# EAGLE schematic Simple_Motherboard (EAGLE 6.5.0)

## Sheet 1 of 7: Power
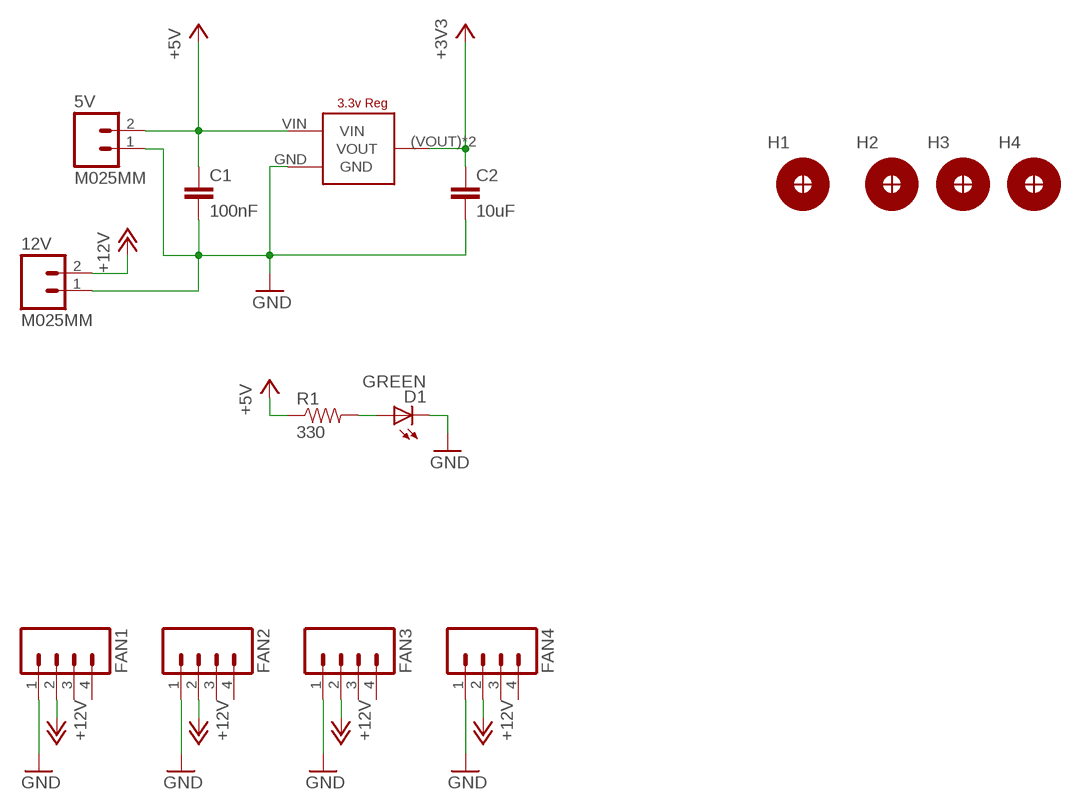
[diagram p0: schematic, sheet 1]

### Parts
5V  M025MM  [SCREWTERMINAL-5MM-2]
12V  M025MM  [SCREWTERMINAL-5MM-2]
C1  100nF  CAP1206  [1206]
C2  10uF  CAP1206  [1206]
D1  GREEN  LED-GREENLARGE  [LED-1206]
FAN1  M04LONGPADS  [1X04_LONGPADS]
FAN2  M04LONGPADS  [1X04_LONGPADS]
FAN3  M04LONGPADS  [1X04_LONGPADS]
FAN4  M04LONGPADS  [1X04_LONGPADS]
H1  H_MNTHOLE_#4  [H_MNTHOLE_#4]
H2  H_MNTHOLE_#4  [H_MNTHOLE_#4]
H3  H_MNTHOLE_#4  [H_MNTHOLE_#4]
H4  H_MNTHOLE_#4  [H_MNTHOLE_#4]
R1  330  RESISTOR1206  [1206]
U$1  LD1117  [LD1117SOT-223]

### Nets
+3V3: C2.1 U$1.(VOUT)(VOUT) U$1.VOUT ; also sheet 3,5,6,7
+5V: 5V.2 C1.1 R1.1 U$1.VIN ; also sheet 2,4,7
+12V: 12V.2 FAN1.2 FAN2.2 FAN3.2 FAN4.2
GND: 5V.1 12V.1 C1.2 C2.2 D1.C FAN1.1 FAN2.1 FAN3.1 FAN4.1 U$1.GND ; also sheet 2,3,4,5,6,7
N$45: D1.A R1.2
Unconnected: FAN1.3 FAN1.4 FAN2.3 FAN2.4 FAN3.3 FAN3.4 FAN4.3 FAN4.4 H1.1 H2.1 H3.1 H4.1

## Sheet 2 of 7: Launchpad
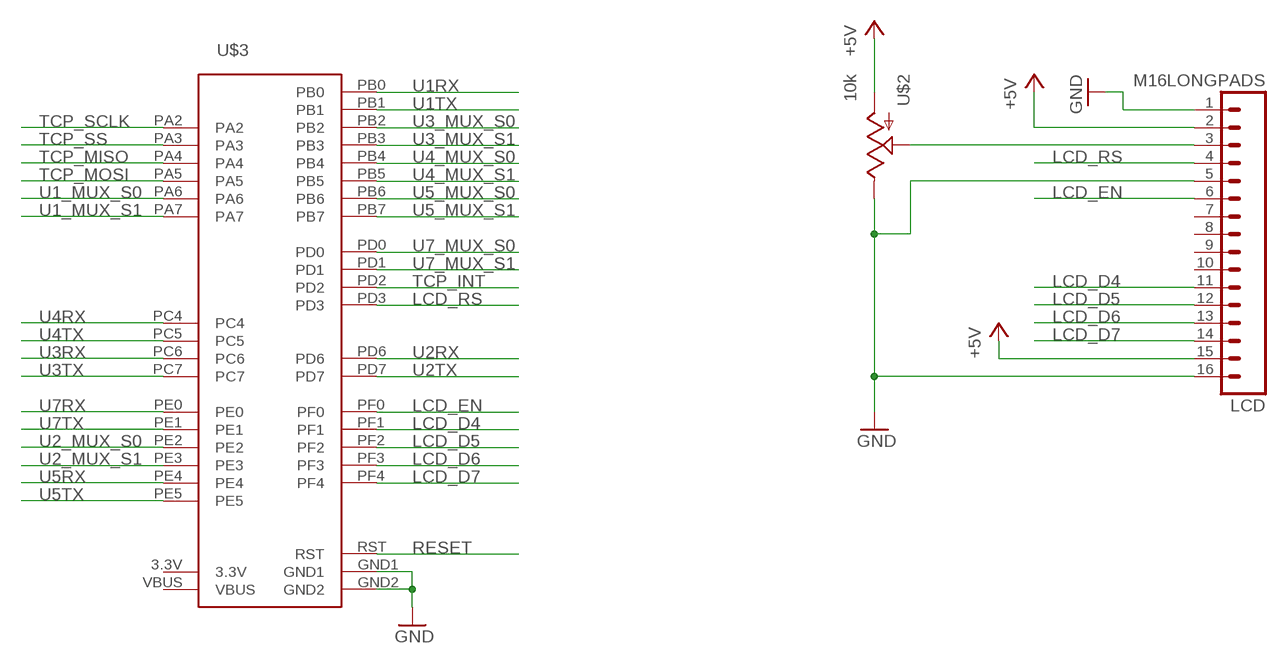
[diagram p1: schematic, sheet 2]

### Parts
LCD  M16LONGPADS  [1X16_LONGPADS]
U$2  10k  POT100K_3362U  [3362U]
U$3  STELLARIS-LAUNCHPADSTELLARIS-LAUNCHPAD-XL  [LAUNCHPAD-XL]

### Nets
+5V: LCD.2 LCD.15 U$2.P$3(A) ; also sheet 1,4,7
GND: LCD.1 LCD.5 LCD.16 U$2.P$1(E) U$3.GND1 U$3.GND2 ; also sheet 1,3,4,5,6,7
LCD_D4: LCD.11 U$3.PF1
LCD_D5: LCD.12 U$3.PF2
LCD_D6: LCD.13 U$3.PF3
LCD_D7: LCD.14 U$3.PF4
LCD_EN: LCD.6 U$3.PF0
LCD_RS: LCD.4 U$3.PD3
N$7: LCD.3 U$2.P$2(S)
RESET: U$3.RST ; also sheet 3,7
TCP_INT: U$3.PD2 ; also sheet 3
TCP_MISO: U$3.PA4 ; also sheet 3
TCP_MOSI: U$3.PA5 ; also sheet 3
TCP_SCLK: U$3.PA2 ; also sheet 3
TCP_SS: U$3.PA3 ; also sheet 3
U1_MUX_S0: U$3.PA6 ; also sheet 4
U1_MUX_S1: U$3.PA7 ; also sheet 4
U1RX: U$3.PB0 ; also sheet 4
U1TX: U$3.PB1 ; also sheet 4
U2_MUX_S0: U$3.PE2 ; also sheet 4
U2_MUX_S1: U$3.PE3 ; also sheet 4
U2RX: U$3.PD6 ; also sheet 4
U2TX: U$3.PD7 ; also sheet 4
U3_MUX_S0: U$3.PB2 ; also sheet 4
U3_MUX_S1: U$3.PB3 ; also sheet 4
U3RX: U$3.PC6 ; also sheet 4
U3TX: U$3.PC7 ; also sheet 4
U4_MUX_S0: U$3.PB4 ; also sheet 4
U4_MUX_S1: U$3.PB5 ; also sheet 4
U4RX: U$3.PC4 ; also sheet 4
U4TX: U$3.PC5 ; also sheet 4
U5_MUX_S0: U$3.PB6 ; also sheet 4
U5_MUX_S1: U$3.PB7 ; also sheet 4
U5RX: U$3.PE4 ; also sheet 4
U5TX: U$3.PE5 ; also sheet 4
U7_MUX_S0: U$3.PD0 ; also sheet 4
U7_MUX_S1: U$3.PD1 ; also sheet 4
U7RX: U$3.PE0 ; also sheet 4
U7TX: U$3.PE1 ; also sheet 4
Unconnected: LCD.7 LCD.8 LCD.9 LCD.10

## Sheet 3 of 7: TCP
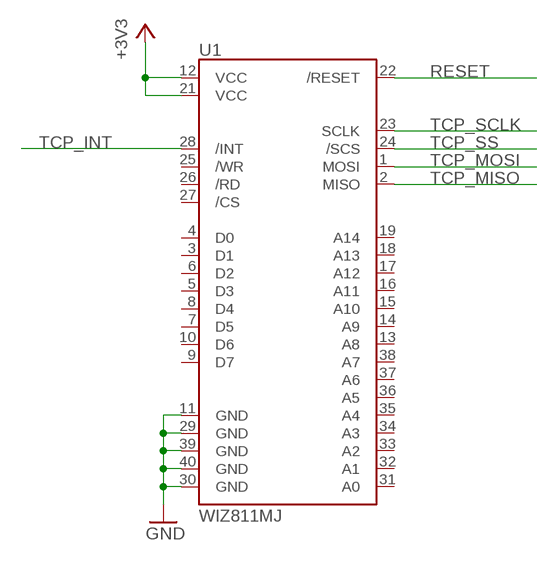
[diagram p2: schematic, sheet 3]

### Parts
U1  WIZ811MJ  [WIZ811MJ]

### Nets
+3V3: U1.12(VCC) U1.21(VCC) ; also sheet 1,5,6,7
GND: U1.11(GND) U1.29(GND) U1.30(GND) U1.39(GND) U1.40(GND) ; also sheet 1,2,4,5,6,7
RESET: U1.22(/RESET) ; also sheet 2,7
TCP_INT: U1.28(/INT) ; also sheet 2
TCP_MISO: U1.2(MISO) ; also sheet 2
TCP_MOSI: U1.1(MOSI) ; also sheet 2
TCP_SCLK: U1.23(SCLK) ; also sheet 2
TCP_SS: U1.24(/SCS) ; also sheet 2
Unconnected: U1.3(D1) U1.4(D0) U1.5(D3) U1.6(D2) U1.7(D5) U1.8(D4) U1.9(D7) U1.10(D6) U1.13(A8) U1.14(A9) U1.15(A10) U1.16(A11) U1.17(A12) U1.18(A13) U1.19(A14) U1.25(/WR) U1.26(/RD) U1.27(/CS) U1.31(A0) U1.32(A1) U1.33(A2) U1.34(A3) U1.35(A4) U1.36(A5) U1.37(A6) U1.38(A7)

## Sheet 4 of 7: Muxes
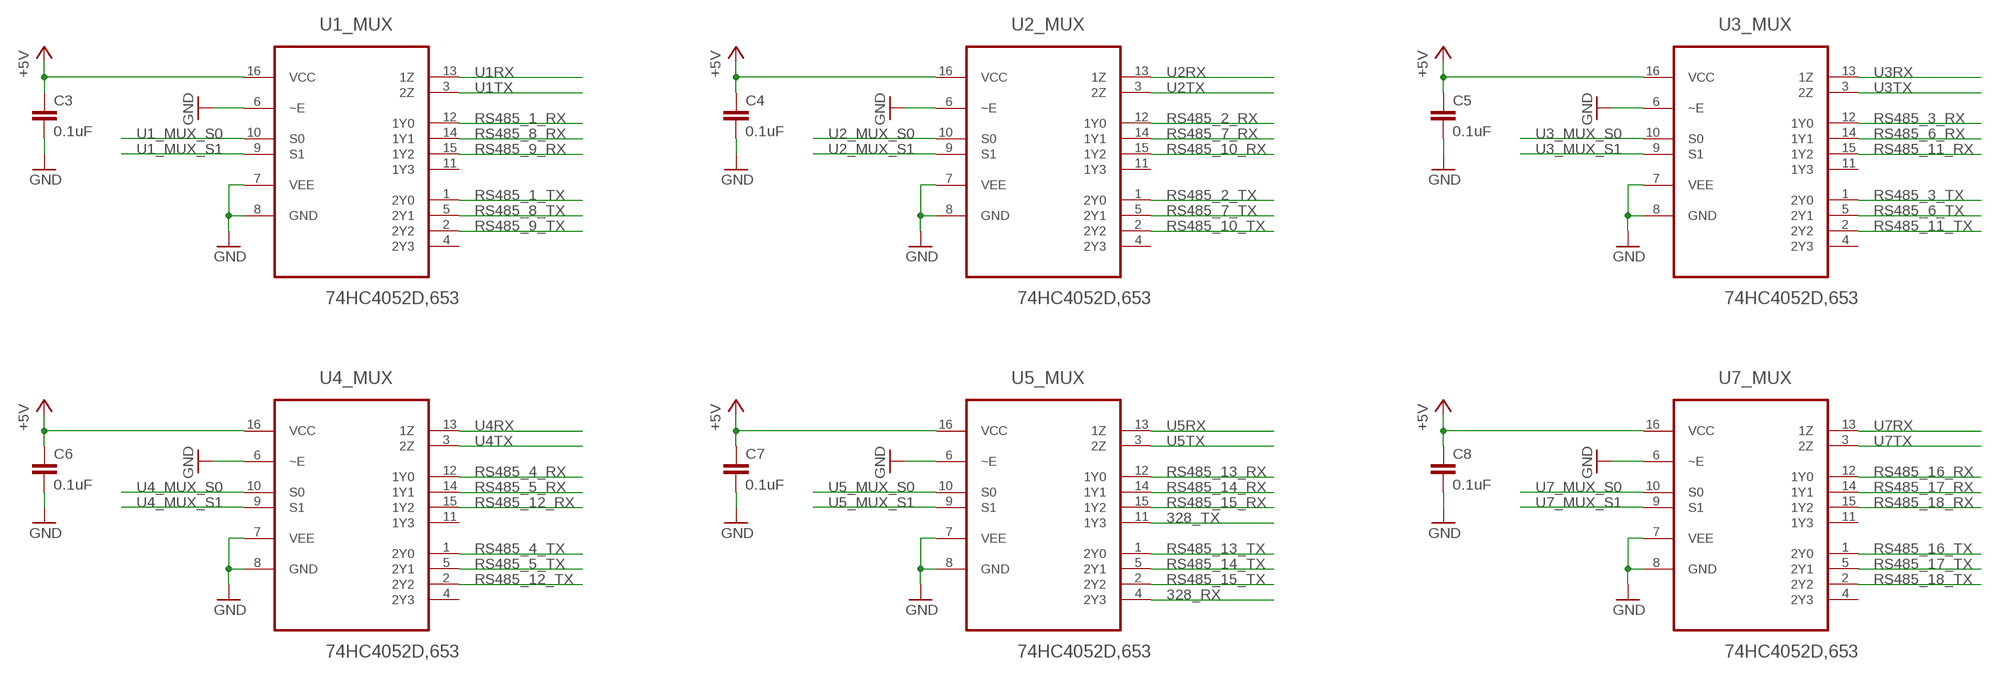
[diagram p3: schematic, sheet 4]

### Parts
C3  0.1uF  CAP1206  [1206]
C4  0.1uF  CAP1206  [1206]
C5  0.1uF  CAP1206  [1206]
C6  0.1uF  CAP1206  [1206]
C7  0.1uF  CAP1206  [1206]
C8  0.1uF  CAP1206  [1206]
U1_MUX  74HC4052D,653  [SOIC127P600X175-16N]
U2_MUX  74HC4052D,653  [SOIC127P600X175-16N]
U3_MUX  74HC4052D,653  [SOIC127P600X175-16N]
U4_MUX  74HC4052D,653  [SOIC127P600X175-16N]
U5_MUX  74HC4052D,653  [SOIC127P600X175-16N]
U7_MUX  74HC4052D,653  [SOIC127P600X175-16N]

### Nets
328_RX: U5_MUX.4(2Y3) ; also sheet 7
328_TX: U5_MUX.11(1Y3) ; also sheet 7
+5V: C3.1 C4.1 C5.1 C6.1 C7.1 C8.1 U1_MUX.16(VCC) U2_MUX.16(VCC) U3_MUX.16(VCC) U4_MUX.16(VCC) U5_MUX.16(VCC) U7_MUX.16(VCC) ; also sheet 1,2,7
GND: C3.2 C4.2 C5.2 C6.2 C7.2 C8.2 U1_MUX.6(~E) U1_MUX.7(VEE) U1_MUX.8(GND) U2_MUX.6(~E) U2_MUX.7(VEE) U2_MUX.8(GND) U3_MUX.6(~E) U3_MUX.7(VEE) U3_MUX.8(GND) U4_MUX.6(~E) U4_MUX.7(VEE) U4_MUX.8(GND) U5_MUX.6(~E) U5_MUX.7(VEE) U5_MUX.8(GND) U7_MUX.6(~E) U7_MUX.7(VEE) U7_MUX.8(GND) ; also sheet 1,2,3,5,6,7
RS485_1_RX: U1_MUX.12(1Y0) ; also sheet 5
RS485_1_TX: U1_MUX.1(2Y0) ; also sheet 5
RS485_2_RX: U2_MUX.12(1Y0) ; also sheet 5
RS485_2_TX: U2_MUX.1(2Y0) ; also sheet 5
RS485_3_RX: U3_MUX.12(1Y0) ; also sheet 5
RS485_3_TX: U3_MUX.1(2Y0) ; also sheet 5
RS485_4_RX: U4_MUX.12(1Y0) ; also sheet 5
RS485_4_TX: U4_MUX.1(2Y0) ; also sheet 5
RS485_5_RX: U4_MUX.14(1Y1) ; also sheet 5
RS485_5_TX: U4_MUX.5(2Y1) ; also sheet 5
RS485_6_RX: U3_MUX.14(1Y1) ; also sheet 5
RS485_6_TX: U3_MUX.5(2Y1) ; also sheet 5
RS485_7_RX: U2_MUX.14(1Y1) ; also sheet 5
RS485_7_TX: U2_MUX.5(2Y1) ; also sheet 5
RS485_8_RX: U1_MUX.14(1Y1) ; also sheet 5
RS485_8_TX: U1_MUX.5(2Y1) ; also sheet 5
RS485_9_RX: U1_MUX.15(1Y2) ; also sheet 5
RS485_9_TX: U1_MUX.2(2Y2) ; also sheet 5
RS485_10_RX: U2_MUX.15(1Y2) ; also sheet 5
RS485_10_TX: U2_MUX.2(2Y2) ; also sheet 5
RS485_11_RX: U3_MUX.15(1Y2) ; also sheet 5
RS485_11_TX: U3_MUX.2(2Y2) ; also sheet 5
RS485_12_RX: U4_MUX.15(1Y2) ; also sheet 5
RS485_12_TX: U4_MUX.2(2Y2) ; also sheet 5
RS485_13_RX: U5_MUX.12(1Y0) ; also sheet 6
RS485_13_TX: U5_MUX.1(2Y0) ; also sheet 6
RS485_14_RX: U5_MUX.14(1Y1) ; also sheet 6
RS485_14_TX: U5_MUX.5(2Y1) ; also sheet 6
RS485_15_RX: U5_MUX.15(1Y2) ; also sheet 6
RS485_15_TX: U5_MUX.2(2Y2) ; also sheet 6
RS485_16_RX: U7_MUX.12(1Y0) ; also sheet 6
RS485_16_TX: U7_MUX.1(2Y0) ; also sheet 6
RS485_17_RX: U7_MUX.14(1Y1) ; also sheet 6
RS485_17_TX: U7_MUX.5(2Y1) ; also sheet 6
RS485_18_RX: U7_MUX.15(1Y2) ; also sheet 6
RS485_18_TX: U7_MUX.2(2Y2) ; also sheet 6
U1_MUX_S0: U1_MUX.10(S0) ; also sheet 2
U1_MUX_S1: U1_MUX.9(S1) ; also sheet 2
U1RX: U1_MUX.13(1Z) ; also sheet 2
U1TX: U1_MUX.3(2Z) ; also sheet 2
U2_MUX_S0: U2_MUX.10(S0) ; also sheet 2
U2_MUX_S1: U2_MUX.9(S1) ; also sheet 2
U2RX: U2_MUX.13(1Z) ; also sheet 2
U2TX: U2_MUX.3(2Z) ; also sheet 2
U3_MUX_S0: U3_MUX.10(S0) ; also sheet 2
U3_MUX_S1: U3_MUX.9(S1) ; also sheet 2
U3RX: U3_MUX.13(1Z) ; also sheet 2
U3TX: U3_MUX.3(2Z) ; also sheet 2
U4_MUX_S0: U4_MUX.10(S0) ; also sheet 2
U4_MUX_S1: U4_MUX.9(S1) ; also sheet 2
U4RX: U4_MUX.13(1Z) ; also sheet 2
U4TX: U4_MUX.3(2Z) ; also sheet 2
U5_MUX_S0: U5_MUX.10(S0) ; also sheet 2
U5_MUX_S1: U5_MUX.9(S1) ; also sheet 2
U5RX: U5_MUX.13(1Z) ; also sheet 2
U5TX: U5_MUX.3(2Z) ; also sheet 2
U7_MUX_S0: U7_MUX.10(S0) ; also sheet 2
U7_MUX_S1: U7_MUX.9(S1) ; also sheet 2
U7RX: U7_MUX.13(1Z) ; also sheet 2
U7TX: U7_MUX.3(2Z) ; also sheet 2
Unconnected: U1_MUX.4(2Y3) U1_MUX.11(1Y3) U2_MUX.4(2Y3) U2_MUX.11(1Y3) U3_MUX.4(2Y3) U3_MUX.11(1Y3) U4_MUX.4(2Y3) U4_MUX.11(1Y3) U7_MUX.4(2Y3) U7_MUX.11(1Y3)

## Sheet 5 of 7: RS-485 External
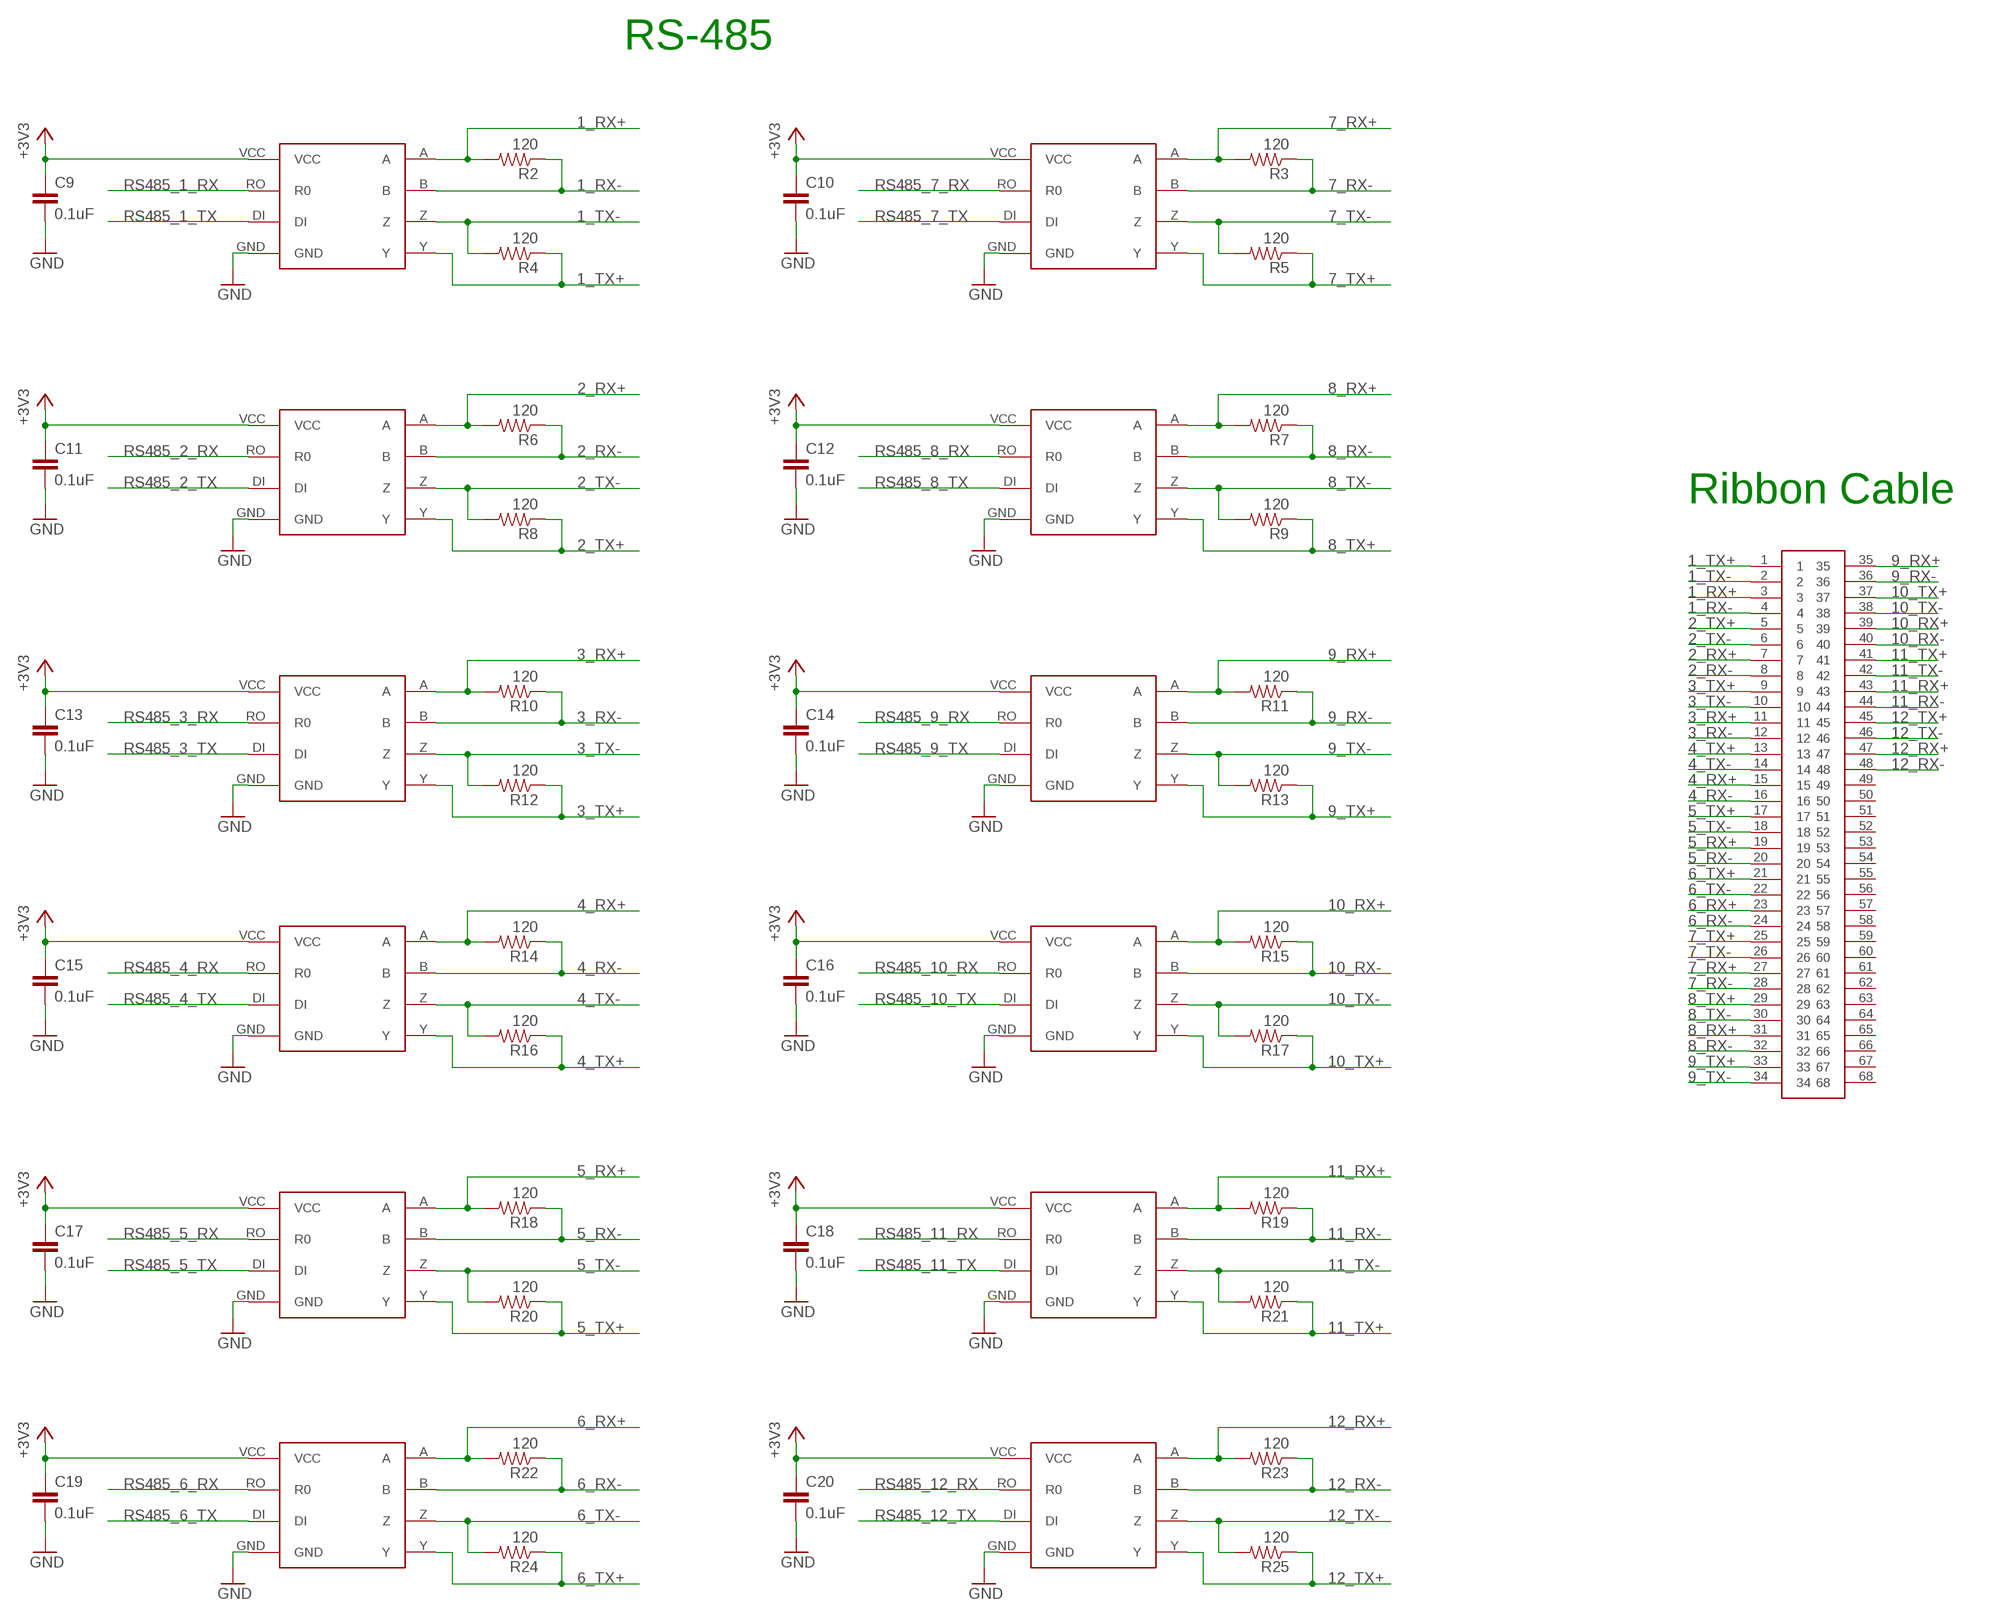
[diagram p4: schematic, sheet 5]

### Parts
C9  0.1uF  CAP1206  [1206]
C10  0.1uF  CAP1206  [1206]
C11  0.1uF  CAP1206  [1206]
C12  0.1uF  CAP1206  [1206]
C13  0.1uF  CAP1206  [1206]
C14  0.1uF  CAP1206  [1206]
C15  0.1uF  CAP1206  [1206]
C16  0.1uF  CAP1206  [1206]
C17  0.1uF  CAP1206  [1206]
C18  0.1uF  CAP1206  [1206]
C19  0.1uF  CAP1206  [1206]
C20  0.1uF  CAP1206  [1206]
R2  120  RESISTOR1206  [1206]
R3  120  RESISTOR1206  [1206]
R4  120  RESISTOR1206  [1206]
R5  120  RESISTOR1206  [1206]
R6  120  RESISTOR1206  [1206]
R7  120  RESISTOR1206  [1206]
R8  120  RESISTOR1206  [1206]
R9  120  RESISTOR1206  [1206]
R10  120  RESISTOR1206  [1206]
R11  120  RESISTOR1206  [1206]
R12  120  RESISTOR1206  [1206]
R13  120  RESISTOR1206  [1206]
R14  120  RESISTOR1206  [1206]
R15  120  RESISTOR1206  [1206]
R16  120  RESISTOR1206  [1206]
R17  120  RESISTOR1206  [1206]
R18  120  RESISTOR1206  [1206]
R19  120  RESISTOR1206  [1206]
R20  120  RESISTOR1206  [1206]
R21  120  RESISTOR1206  [1206]
R22  120  RESISTOR1206  [1206]
R23  120  RESISTOR1206  [1206]
R24  120  RESISTOR1206  [1206]
R25  120  RESISTOR1206  [1206]
RS_TRANS_1  MAX3077  [MAX3070E]
RS_TRANS_2  MAX3077  [MAX3070E]
RS_TRANS_3  MAX3077  [MAX3070E]
RS_TRANS_4  MAX3077  [MAX3070E]
RS_TRANS_5  MAX3077  [MAX3070E]
RS_TRANS_6  MAX3077  [MAX3070E]
RS_TRANS_7  MAX3077  [MAX3070E]
RS_TRANS_8  MAX3077  [MAX3070E]
RS_TRANS_9  MAX3077  [MAX3070E]
RS_TRANS_10  MAX3077  [MAX3070E]
RS_TRANS_11  MAX3077  [MAX3070E]
RS_TRANS_12  MAX3077  [MAX3070E]
U$4  TB60050685100  [60050685100]

### Nets
1_RX+: R2.2 RS_TRANS_1.A U$4.3
1_RX-: R2.1 RS_TRANS_1.B U$4.4
1_TX+: R4.1 RS_TRANS_1.Y U$4.1
1_TX-: R4.2 RS_TRANS_1.Z U$4.2
2_RX+: R6.2 RS_TRANS_3.A U$4.7
2_RX-: R6.1 RS_TRANS_3.B U$4.8
2_TX+: R8.1 RS_TRANS_3.Y U$4.5
2_TX-: R8.2 RS_TRANS_3.Z U$4.6
3_RX+: R10.2 RS_TRANS_5.A U$4.11
3_RX-: R10.1 RS_TRANS_5.B U$4.12
3_TX+: R12.1 RS_TRANS_5.Y U$4.9
3_TX-: R12.2 RS_TRANS_5.Z U$4.10
4_RX+: R14.2 RS_TRANS_7.A U$4.15
4_RX-: R14.1 RS_TRANS_7.B U$4.16
4_TX+: R16.1 RS_TRANS_7.Y U$4.13
4_TX-: R16.2 RS_TRANS_7.Z U$4.14
5_RX+: R18.2 RS_TRANS_9.A U$4.19
5_RX-: R18.1 RS_TRANS_9.B U$4.20
5_TX+: R20.1 RS_TRANS_9.Y U$4.17
5_TX-: R20.2 RS_TRANS_9.Z U$4.18
6_RX+: R22.2 RS_TRANS_11.A U$4.23
6_RX-: R22.1 RS_TRANS_11.B U$4.24
6_TX+: R24.1 RS_TRANS_11.Y U$4.21
6_TX-: R24.2 RS_TRANS_11.Z U$4.22
7_RX+: R3.2 RS_TRANS_2.A U$4.27
7_RX-: R3.1 RS_TRANS_2.B U$4.28
7_TX+: R5.1 RS_TRANS_2.Y U$4.25
7_TX-: R5.2 RS_TRANS_2.Z U$4.26
8_RX+: R7.2 RS_TRANS_4.A U$4.31
8_RX-: R7.1 RS_TRANS_4.B U$4.32
8_TX+: R9.1 RS_TRANS_4.Y U$4.29
8_TX-: R9.2 RS_TRANS_4.Z U$4.30
9_RX+: R11.2 RS_TRANS_6.A U$4.35
9_RX-: R11.1 RS_TRANS_6.B U$4.36
9_TX+: R13.1 RS_TRANS_6.Y U$4.33
9_TX-: R13.2 RS_TRANS_6.Z U$4.34
10_RX+: R15.2 RS_TRANS_8.A U$4.39
10_RX-: R15.1 RS_TRANS_8.B U$4.40
10_TX+: R17.1 RS_TRANS_8.Y U$4.37
10_TX-: R17.2 RS_TRANS_8.Z U$4.38
11_RX+: R19.2 RS_TRANS_10.A U$4.43
11_RX-: R19.1 RS_TRANS_10.B U$4.44
11_TX+: R21.1 RS_TRANS_10.Y U$4.41
11_TX-: R21.2 RS_TRANS_10.Z U$4.42
12_RX+: R23.2 RS_TRANS_12.A U$4.47
12_RX-: R23.1 RS_TRANS_12.B U$4.48
12_TX+: R25.1 RS_TRANS_12.Y U$4.45
12_TX-: R25.2 RS_TRANS_12.Z U$4.46
+3V3: C9.1 C10.1 C11.1 C12.1 C13.1 C14.1 C15.1 C16.1 C17.1 C18.1 C19.1 C20.1 RS_TRANS_1.VCC RS_TRANS_2.VCC RS_TRANS_3.VCC RS_TRANS_4.VCC RS_TRANS_5.VCC RS_TRANS_6.VCC RS_TRANS_7.VCC RS_TRANS_8.VCC RS_TRANS_9.VCC RS_TRANS_10.VCC RS_TRANS_11.VCC RS_TRANS_12.VCC ; also sheet 1,3,6,7
GND: C9.2 C10.2 C11.2 C12.2 C13.2 C14.2 C15.2 C16.2 C17.2 C18.2 C19.2 C20.2 RS_TRANS_1.GND RS_TRANS_2.GND RS_TRANS_3.GND RS_TRANS_4.GND RS_TRANS_5.GND RS_TRANS_6.GND RS_TRANS_7.GND RS_TRANS_8.GND RS_TRANS_9.GND RS_TRANS_10.GND RS_TRANS_11.GND RS_TRANS_12.GND ; also sheet 1,2,3,4,6,7
RS485_1_RX: RS_TRANS_1.RO(R0) ; also sheet 4
RS485_1_TX: RS_TRANS_1.DI ; also sheet 4
RS485_2_RX: RS_TRANS_3.RO(R0) ; also sheet 4
RS485_2_TX: RS_TRANS_3.DI ; also sheet 4
RS485_3_RX: RS_TRANS_5.RO(R0) ; also sheet 4
RS485_3_TX: RS_TRANS_5.DI ; also sheet 4
RS485_4_RX: RS_TRANS_7.RO(R0) ; also sheet 4
RS485_4_TX: RS_TRANS_7.DI ; also sheet 4
RS485_5_RX: RS_TRANS_9.RO(R0) ; also sheet 4
RS485_5_TX: RS_TRANS_9.DI ; also sheet 4
RS485_6_RX: RS_TRANS_11.RO(R0) ; also sheet 4
RS485_6_TX: RS_TRANS_11.DI ; also sheet 4
RS485_7_RX: RS_TRANS_2.RO(R0) ; also sheet 4
RS485_7_TX: RS_TRANS_2.DI ; also sheet 4
RS485_8_RX: RS_TRANS_4.RO(R0) ; also sheet 4
RS485_8_TX: RS_TRANS_4.DI ; also sheet 4
RS485_9_RX: RS_TRANS_6.RO(R0) ; also sheet 4
RS485_9_TX: RS_TRANS_6.DI ; also sheet 4
RS485_10_RX: RS_TRANS_8.RO(R0) ; also sheet 4
RS485_10_TX: RS_TRANS_8.DI ; also sheet 4
RS485_11_RX: RS_TRANS_10.RO(R0) ; also sheet 4
RS485_11_TX: RS_TRANS_10.DI ; also sheet 4
RS485_12_RX: RS_TRANS_12.RO(R0) ; also sheet 4
RS485_12_TX: RS_TRANS_12.DI ; also sheet 4
Unconnected: U$4.49 U$4.50 U$4.51 U$4.52 U$4.53 U$4.54 U$4.55 U$4.56 U$4.57 U$4.58 U$4.59 U$4.60 U$4.61 U$4.62 U$4.63 U$4.64 U$4.65 U$4.66 U$4.67 U$4.68

### Notes on the sheet
- RS-485
- Ribbon Cable

## Sheet 6 of 7: RS-485 Internal
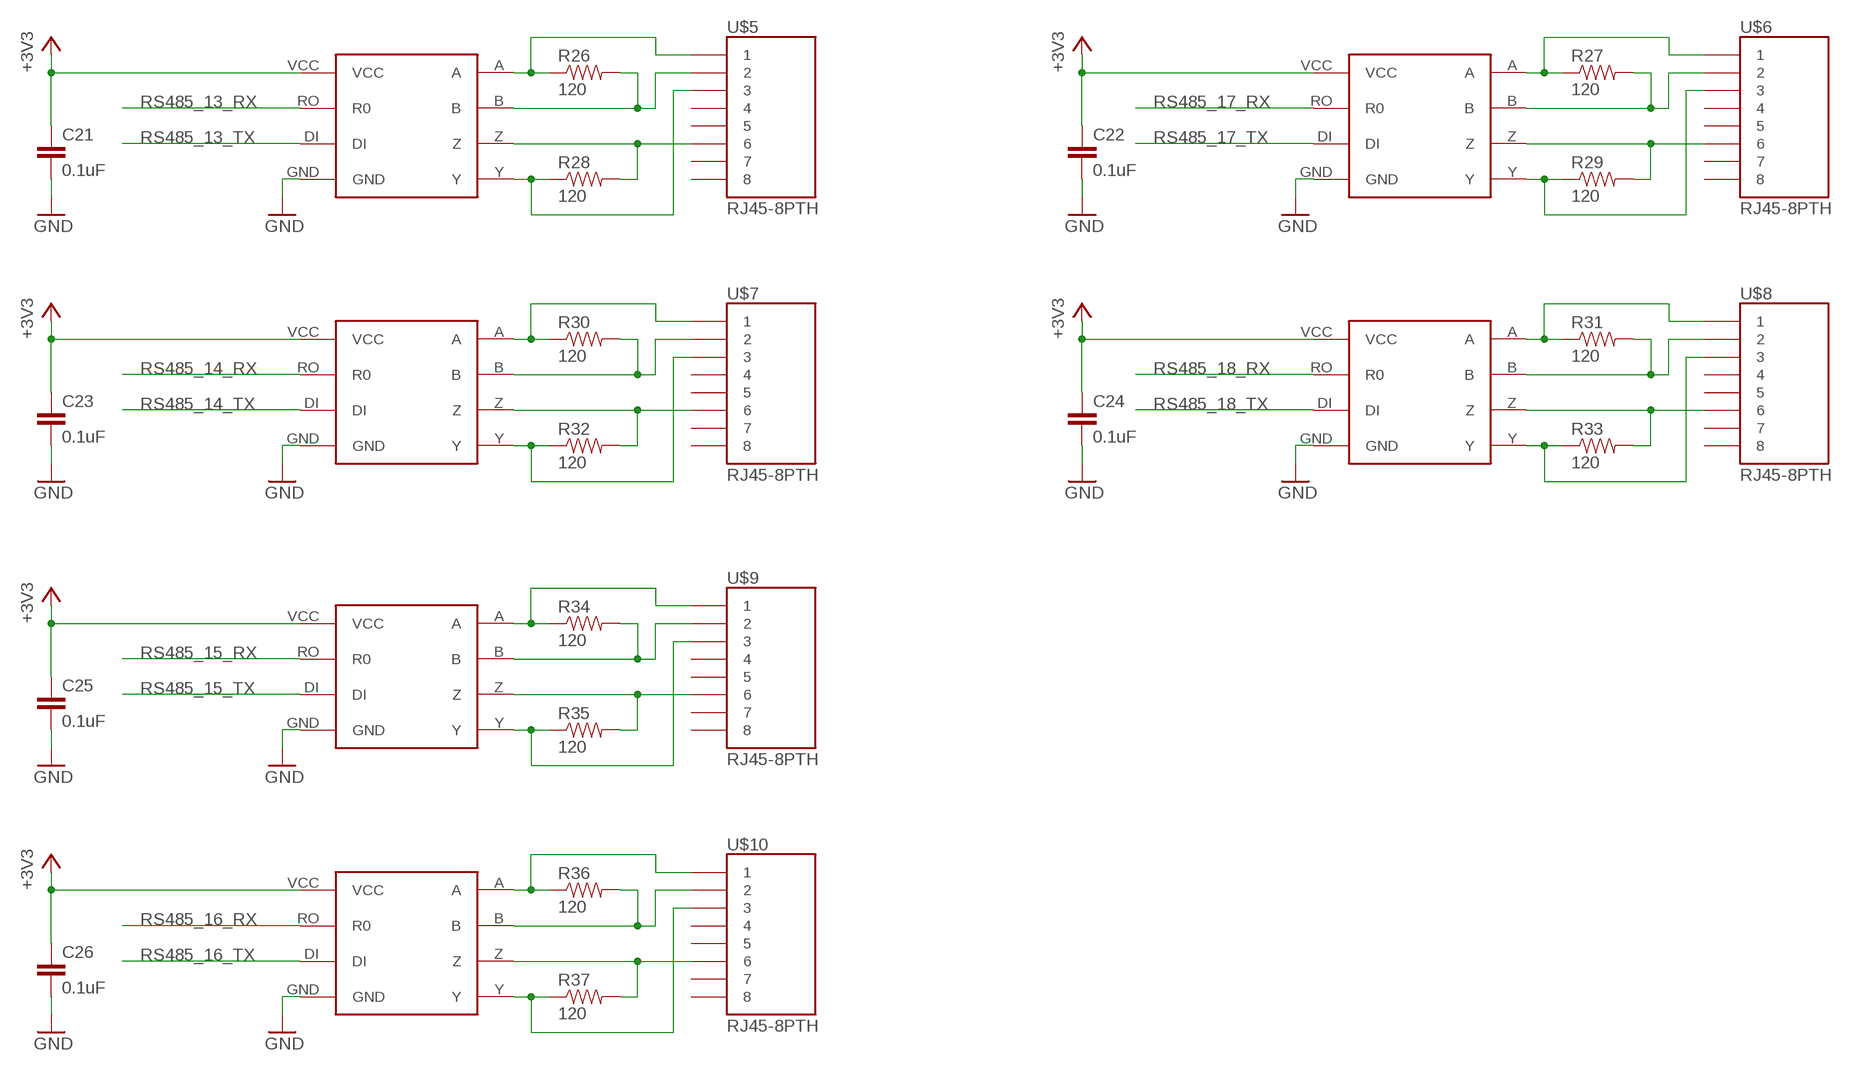
[diagram p5: schematic, sheet 6]

### Parts
C21  0.1uF  CAP1206  [1206]
C22  0.1uF  CAP1206  [1206]
C23  0.1uF  CAP1206  [1206]
C24  0.1uF  CAP1206  [1206]
C25  0.1uF  CAP1206  [1206]
C26  0.1uF  CAP1206  [1206]
R26  120  RESISTOR1206  [1206]
R27  120  RESISTOR1206  [1206]
R28  120  RESISTOR1206  [1206]
R29  120  RESISTOR1206  [1206]
R30  120  RESISTOR1206  [1206]
R31  120  RESISTOR1206  [1206]
R32  120  RESISTOR1206  [1206]
R33  120  RESISTOR1206  [1206]
R34  120  RESISTOR1206  [1206]
R35  120  RESISTOR1206  [1206]
R36  120  RESISTOR1206  [1206]
R37  120  RESISTOR1206  [1206]
RS-485-1  MAX3077  [MAX3070E]
RS-485-2  MAX3077  [MAX3070E]
RS-485-3  MAX3077  [MAX3070E]
RS-485-4  MAX3077  [MAX3070E]
RS-485-5  MAX3077  [MAX3070E]
RS-485-6  MAX3077  [MAX3070E]
U$5  RJ45-8PTH  [RJ45-8]
U$6  RJ45-8PTH  [RJ45-8]
U$7  RJ45-8PTH  [RJ45-8]
U$8  RJ45-8PTH  [RJ45-8]
U$9  RJ45-8PTH  [RJ45-8]
U$10  RJ45-8PTH  [RJ45-8]

### Nets
+3V3: C21.1 C22.1 C23.1 C24.1 C25.1 C26.1 RS-485-1.VCC RS-485-2.VCC RS-485-3.VCC RS-485-4.VCC RS-485-5.VCC RS-485-6.VCC ; also sheet 1,3,5,7
GND: C21.2 C22.2 C23.2 C24.2 C25.2 C26.2 RS-485-1.GND RS-485-2.GND RS-485-3.GND RS-485-4.GND RS-485-5.GND RS-485-6.GND ; also sheet 1,2,3,4,5,7
N$1: R26.1 RS-485-1.A U$5.1
N$2: R26.2 RS-485-1.B U$5.2
N$4: R28.1 RS-485-1.Y U$5.3
N$8: R32.2 RS-485-3.Z U$7.6
N$9: R28.2 RS-485-1.Z U$5.6
N$10: R30.1 RS-485-3.A U$7.1
N$11: R30.2 RS-485-3.B U$7.2
N$12: R32.1 RS-485-3.Y U$7.3
N$13: R35.2 RS-485-5.Z U$9.6
N$14: R34.1 RS-485-5.A U$9.1
N$15: R34.2 RS-485-5.B U$9.2
N$16: R35.1 RS-485-5.Y U$9.3
N$17: R37.2 RS-485-6.Z U$10.6
N$18: R36.1 RS-485-6.A U$10.1
N$19: R36.2 RS-485-6.B U$10.2
N$20: R37.1 RS-485-6.Y U$10.3
N$21: R29.2 RS-485-2.Z U$6.6
N$22: R27.1 RS-485-2.A U$6.1
N$28: R27.2 RS-485-2.B U$6.2
N$29: R29.1 RS-485-2.Y U$6.3
N$33: R33.2 RS-485-4.Z U$8.6
N$34: R31.1 RS-485-4.A U$8.1
N$35: R31.2 RS-485-4.B U$8.2
N$36: R33.1 RS-485-4.Y U$8.3
RS485_13_RX: RS-485-1.RO(R0) ; also sheet 4
RS485_13_TX: RS-485-1.DI ; also sheet 4
RS485_14_RX: RS-485-3.RO(R0) ; also sheet 4
RS485_14_TX: RS-485-3.DI ; also sheet 4
RS485_15_RX: RS-485-5.RO(R0) ; also sheet 4
RS485_15_TX: RS-485-5.DI ; also sheet 4
RS485_16_RX: RS-485-6.RO(R0) ; also sheet 4
RS485_16_TX: RS-485-6.DI ; also sheet 4
RS485_17_RX: RS-485-2.RO(R0) ; also sheet 4
RS485_17_TX: RS-485-2.DI ; also sheet 4
RS485_18_RX: RS-485-4.RO(R0) ; also sheet 4
RS485_18_TX: RS-485-4.DI ; also sheet 4
Unconnected: U$5.4 U$5.5 U$5.7 U$5.8 U$6.4 U$6.5 U$6.7 U$6.8 U$7.4 U$7.5 U$7.7 U$7.8 U$8.4 U$8.5 U$8.7 U$8.8 U$9.4 U$9.5 U$9.7 U$9.8 U$10.4 U$10.5 U$10.7 U$10.8

## Sheet 7 of 7: Sensors
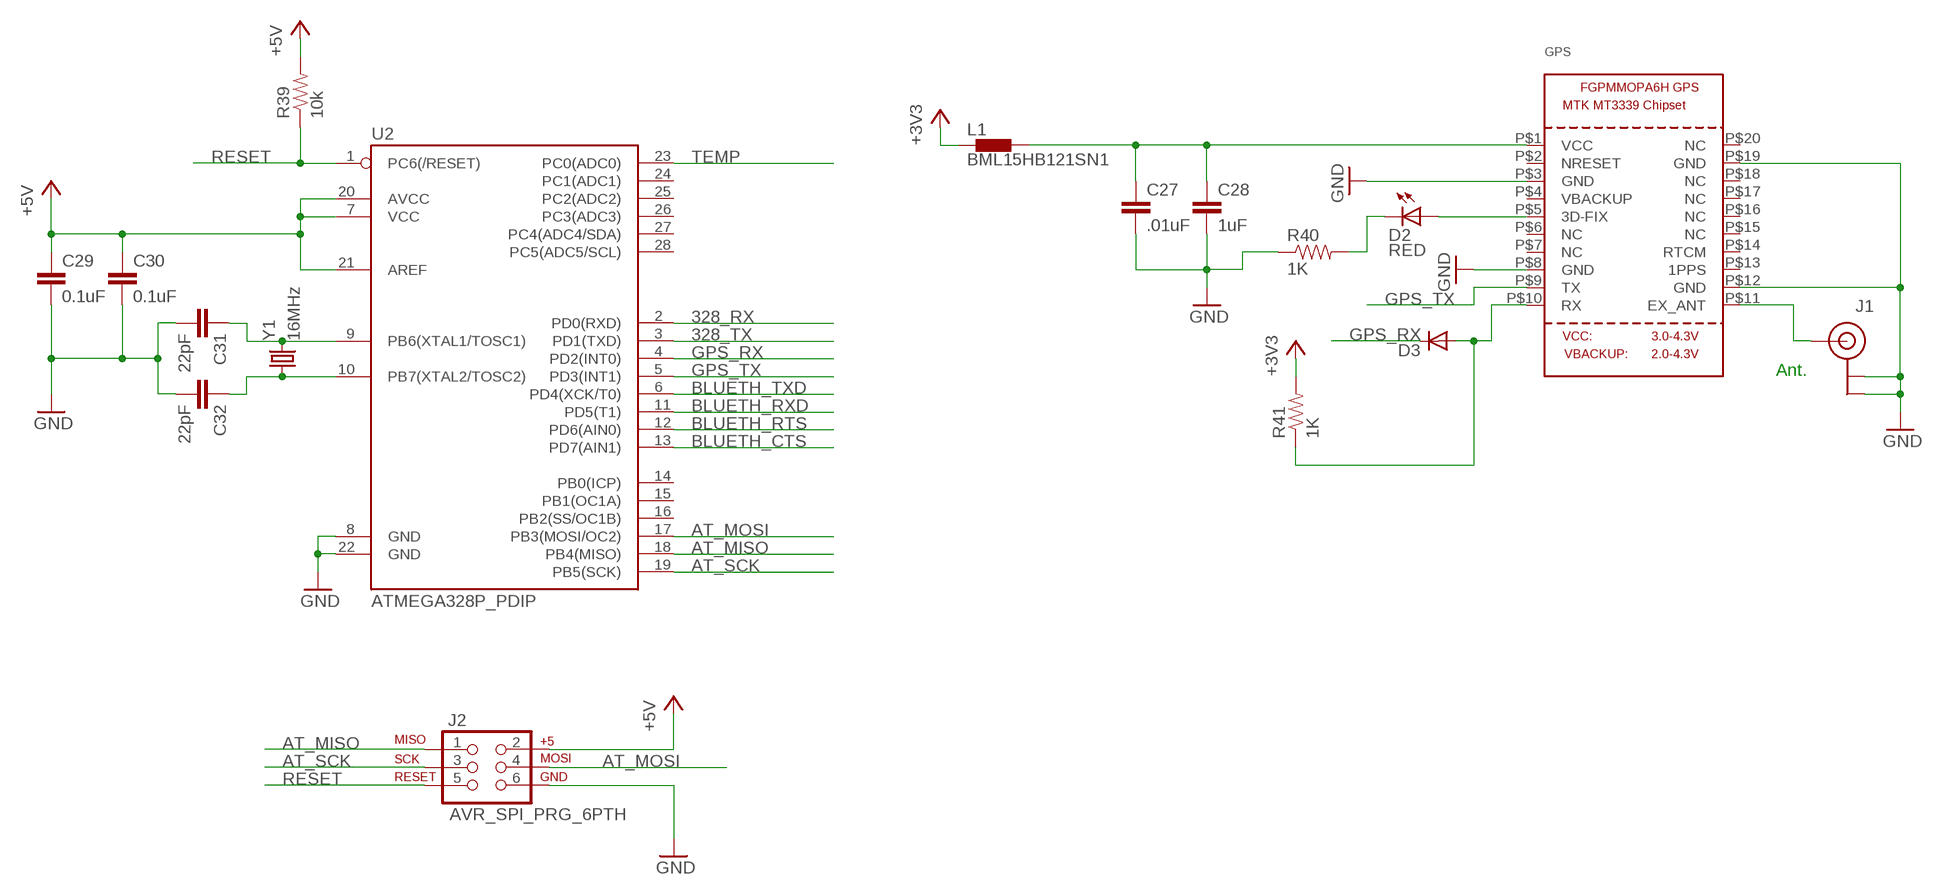
[diagram p6: schematic, sheet 7]

### Parts
C27  .01uF  CAP1206  [1206]
C28  1uF  CAP1206  [1206]
C29  0.1uF  CAP1206  [1206]
C30  0.1uF  CAP1206  [1206]
C31  22pF  CAP1206  [1206]
C32  22pF  CAP1206  [1206]
D2  RED  LED-RED1206  [LED-1206]
D3  DIODEHV  [DIODE-HV]
GPS  GPS_FGPMMOPA6H  [FGPMMOPA6H]
J1  U.FL  [U.FL]
J2  AVR_SPI_PRG_6PTH  [2X3]
L1  BML15HB121SN1  [0402]
R39  10k  RESISTOR1206  [1206]
R40  1K  RESISTOR1206  [1206]
R41  1K  RESISTOR1206  [1206]
U2  ATMEGA328P_PDIP  [DIL28-3]
Y1  16MHz  CRYSTALHC49US  [HC49US]

### Nets
328_RX: U2.2(PD0(RXD)) ; also sheet 4
328_TX: U2.3(PD1(TXD)) ; also sheet 4
+3V3: L1.1 R41.2 ; also sheet 1,3,5,6
+5V: C29.1 C30.1 J2.2 R39.2 U2.7(VCC) U2.20(AVCC) U2.21(AREF) ; also sheet 1,2,4
AT_MISO: J2.1 U2.18(PB4(MISO))
AT_MOSI: J2.4 U2.17(PB3(MOSI/OC2))
AT_SCK: J2.3 U2.19(PB5(SCK))
ATCLK3: C32.1 U2.10(PB7(XTAL2/TOSC2)) Y1.1
ATCLK4: C31.1 U2.9(PB6(XTAL1/TOSC1)) Y1.2
BLUETH_CTS: U2.13(PD7(AIN1))
BLUETH_RTS: U2.12(PD6(AIN0))
BLUETH_RXD: U2.11(PD5(T1))
BLUETH_TXD: U2.6(PD4(XCK/T0))
GND: C27.2 C28.2 C29.2 C30.2 C31.2 C32.2 GPS.P$3(GND) GPS.P$8(GND) GPS.P$12(GND) GPS.P$19(GND) J1.P$1(GND) J1.P$2(GND) J2.6 R40.1 U2.8(GND) U2.22(GND) ; also sheet 1,2,3,4,5,6
GPS_RX: D3.C U2.4(PD2(INT0))
GPS_TX: GPS.P$9(TX) U2.5(PD3(INT1))
N$5: GPS.P$11(EX_ANT) J1.P$3(SIGNAL)
N$6: D2.C R40.2
N$23: D2.A GPS.P$5(3D-FIX)
N$24: D3.A GPS.P$10(RX) R41.1
N$47: C27.1 C28.1 GPS.P$1(VCC) L1.2
RESET: J2.5 R39.1 U2.1(PC6(/RESET)) ; also sheet 2,3
TEMP: U2.23(PC0(ADC0))
Unconnected: GPS.P$2(NRESET) GPS.P$4(VBACKUP) GPS.P$6(NC) GPS.P$7(NC) GPS.P$13(1PPS) GPS.P$14(RTCM) GPS.P$15(NC) GPS.P$16(NC) GPS.P$17(NC) GPS.P$18(NC) GPS.P$20(NC) U2.14(PB0(ICP)) U2.15(PB1(OC1A)) U2.16(PB2(SS/OC1B)) U2.24(PC1(ADC1)) U2.25(PC2(ADC2)) U2.26(PC3(ADC3)) U2.27(PC4(ADC4/SDA)) U2.28(PC5(ADC5/SCL))

### Notes on the sheet
- Ant.

## Power pins joined to a net without a drawn wire
3.3V: U$3.3.3V
VBUS: U$3.VBUS

## Library data of the parts
5V 12V = SparkFun-Connectors:M02: Standard 2-pin 0.1" header. Use with - straight break away headers ( PRT-00116) - right angle break away headers (PRT-00553) - swiss pins (PRT-00743) - machine pins (PRT-00117) - female headers (PRT-00115) Molex polarized connector foot print use with: PRT-08233 with associated crimp pins and housings. 2.54_SCREWTERM for use with PRT-10571. 3.5mm Screw Terminal footprints for PRT-08084 5mm Screw Terminal footprints for use with PRT-08433
C1-C32 = SparkFun-Passives:CAP: Capacitor Standard 0603 ceramic capacitor, and 0.1" leaded capacitor.
D1 = SparkFun-LED:LED-GREEN: Various green LEDs 0603- DIO-00821 LARGE- DIO-00862 LILYPAD- DIO-09910; PROD_ID: DIO-00862
D2 = SparkFun-LED:LED-RED: Assorted Red LEDs LilyPad 1206- DIO-09912 1206- DIO-00809 0603- DIO-00819; PROD_ID: DIO-00809
D3 = SparkFun-DiscreteSemi:DIODE: Diode These are standard reverse protection diodes and small signal diodes. SMA package can handle up to about 1A. SOD-323 can handle about 200mA. What the SOD-323 package when ordering, there are some mfgs out there that are 5-pin packages.
FAN1-FAN4 = SparkFun-Connectors:M04: Header 4 Standard 4-pin 0.1" header. Use with straight break away headers (SKU : PRT-00116), right angle break away headers (PRT-00553), swiss pins (PRT-00743), machine pins (PRT-00117), and female headers (PRT-00115). Molex polarized connector foot print use with SKU : PRT-08231 with associated crimp pins and housings. 1MM SMD Version SKU: PRT-10208
GPS = adafruit:GPS_FGPMMOPA6H: GPS Module - MTK MT3339 Chipset, -165dBm sensitivity, 22 channels, 10Hz, auto-select external antenna options
H1-H4 = Lib_TH:H_MNTHOLE
J1 = SparkFun-Connectors:U.FL: SMD antenna connector- WRL-09144
J2 = SparkFun-Connectors:AVR_SPI_PRG_6: AVR ISP 6 Pin This is the reduced ISP connector for AVR programming. Common on Arduino. This footprint will take up less PCB space and can be used with a 10-pin to 6-pin adapter such as SKU: BOB-08508
L1 = inductors:BML15H: EMIFIL (R) Chip Ferrite Bead for GHz Noise Source: http://www.murata.com/ Ferrite Bead BLM15H.pdf
LCD = SparkFun-Connectors:M16: 1x16 .1" header
R1-R37 R40 R41 = SparkFun-Passives:RESISTOR: Resistor Basic schematic elements and footprints for 0603, 1206, and PTH resistors.
R39 = SparkFun-Resistors:RESISTOR: Resistor Basic schematic elements and footprints for 0603, 1206, and PTH resistors.
RS-485-1-RS-485-6 RS_TRANS_1-RS_TRANS_12 = MAX3077:MAX3077
U1 = SparkFun-Boards:WIZ811MJ: WIZnet W5100 Network Module with MagJack - WIZ811MJ WIZnet's WIZ811MJ is a breakout board for the W5100 embedded TCP/IP chip. Also included on the board is a RJ-45 MagJack Connector (RJ45 with X'FMR). See http://www.sparkfun.com/commerce/product_info.php?products_id=9473 for more documentation and info. **UNPROVEN
U1_MUX U2_MUX U3_MUX U4_MUX U5_MUX U7_MUX = 4x1_Dual_Mux:74HC4052D,653: Dual 4-channel analog multiplexer/demultiplexer; MPN: 74HC4052D,653; OC_FARNELL: 1826642; OC_NEWARK: 78R7402; PACKAGE: SO-16; SUPPLIER: NXP
U2 = SparkFun-DigitalIC:ATMEGA328P_PDIP: uC used in the Arduino 32kb flash, 1k EEPROM, 2k SRAM This is the through-hole version of this chip.
U$1 = LD1117:LD1117
U$2 = SparkFun-Electromechanical:POT
U$3 = StellarisLaunchPad_Fred:STELLARIS-LAUNCHPAD
U$4 = harting-scsi:TB60050685100
U$5-U$10 = SparkFun-Connectors:RJ45-8: RJ45 Jack Simple RJ45, 8-pin connection - connector for common Cat5, Cat5e, and Cat6 Ethernet cables. Footprint not yet proven in production. Connector sku is PRT-00643; Breakout PCB sku is BOB-00716.
Y1 = SparkFun-FreqCtrl:CRYSTAL: Various standard crystals. Proven footprints. Spark Fun Electronics SKU : COM-00534